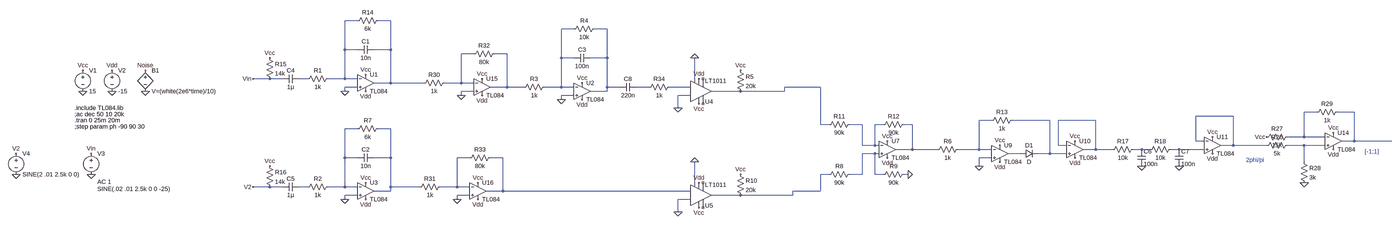
[diagram p0: schematic circuit_complet.asc, whole sheet]
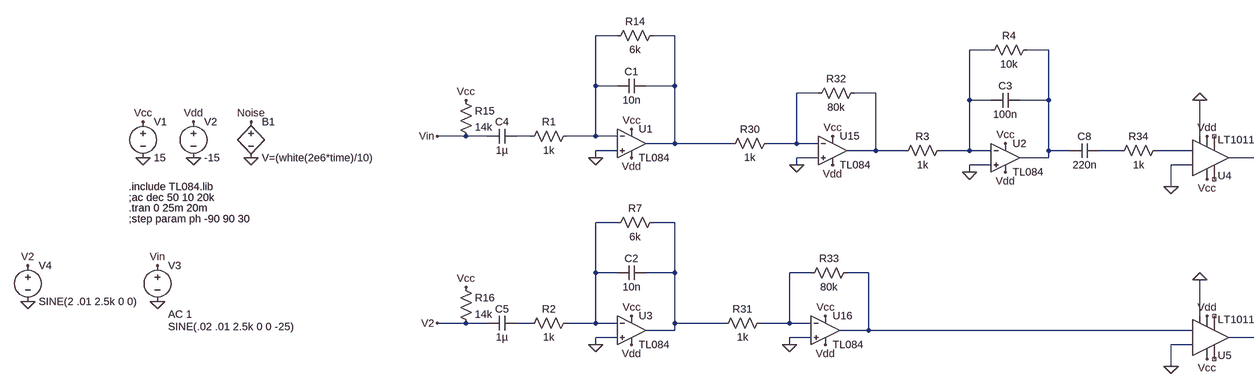
[diagram p1: schematic circuit_complet.asc, part, row 1 of 1, column 1 of 2]
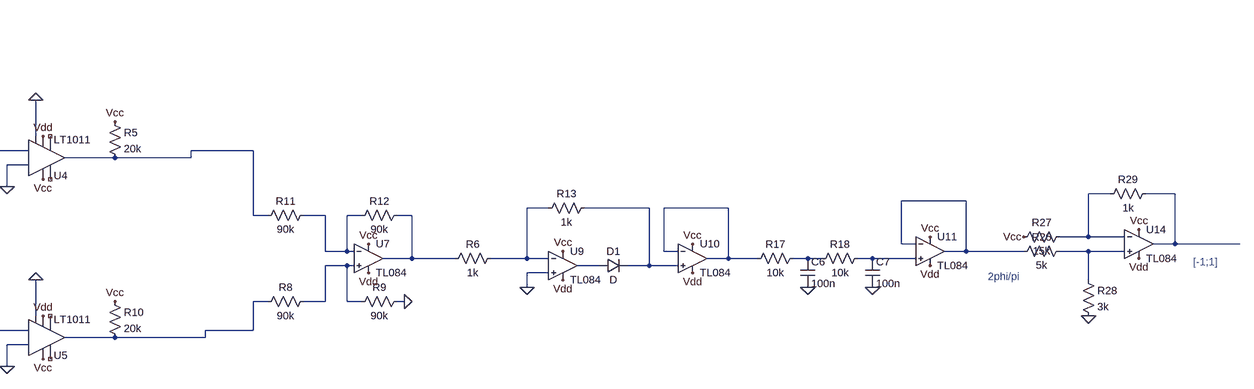
[diagram p2: schematic circuit_complet.asc, part, row 1 of 1, column 2 of 2]
circuit_complet.asc, the LTspice schematic file:
Version 4
SHEET 1 5272 756
WIRE -304 -64 -352 -64
WIRE -176 -64 -224 -64
WIRE 560 -32 512 -32
WIRE 688 -32 640 -32
WIRE -352 48 -352 -64
WIRE -304 48 -352 48
WIRE -176 48 -176 -64
WIRE -176 48 -240 48
WIRE 176 64 128 64
WIRE 304 64 256 64
WIRE 512 80 512 -32
WIRE 560 80 512 80
WIRE 688 80 688 -32
WIRE 688 80 624 80
WIRE -640 160 -704 160
WIRE -592 160 -640 160
WIRE -496 160 -528 160
WIRE -352 160 -352 48
WIRE -352 160 -416 160
WIRE -304 160 -352 160
WIRE 1024 160 1024 80
WIRE -176 176 -176 48
WIRE -176 176 -240 176
WIRE -16 176 -176 176
WIRE 128 176 128 64
WIRE 128 176 64 176
WIRE 176 176 128 176
WIRE -304 192 -352 192
WIRE 304 192 304 64
WIRE 304 192 240 192
WIRE 368 192 304 192
WIRE 512 192 512 80
WIRE 512 192 448 192
WIRE 560 192 512 192
WIRE 688 192 688 80
WIRE 736 192 688 192
WIRE 848 192 800 192
WIRE 1008 192 928 192
WIRE 1664 192 1472 192
WIRE -352 208 -352 192
WIRE 176 208 128 208
WIRE 688 208 688 192
WIRE 688 208 624 208
WIRE 1200 208 1088 208
WIRE 1472 208 1472 192
WIRE 1472 208 1200 208
WIRE 128 224 128 208
WIRE 560 224 512 224
WIRE 1008 224 960 224
WIRE 512 240 512 224
WIRE 960 272 960 224
WIRE 3568 288 3520 288
WIRE 3712 288 3648 288
WIRE 3248 304 3104 304
WIRE 2320 320 2272 320
WIRE 2544 320 2400 320
WIRE 2720 320 2576 320
WIRE 1664 336 1664 192
WIRE 1696 336 1664 336
WIRE 1824 336 1776 336
WIRE 1904 336 1872 336
WIRE 2016 336 1984 336
WIRE -304 352 -352 352
WIRE -176 352 -224 352
WIRE 3520 384 3520 288
WIRE 3520 384 3456 384
WIRE 3600 384 3520 384
WIRE 3104 400 3104 304
WIRE 3136 400 3104 400
WIRE 3712 400 3712 288
WIRE 3712 400 3664 400
WIRE 3856 400 3712 400
WIRE 1824 416 1824 336
WIRE 1872 416 1872 336
WIRE 1872 416 1824 416
WIRE 1888 416 1872 416
WIRE 2576 416 2576 320
WIRE 2608 416 2576 416
WIRE 3248 416 3248 304
WIRE 3248 416 3200 416
WIRE 3376 416 3248 416
WIRE 3520 416 3456 416
WIRE 3600 416 3520 416
WIRE 2016 432 2016 336
WIRE 2016 432 1952 432
WIRE 2112 432 2016 432
WIRE 2272 432 2272 320
WIRE 2272 432 2192 432
WIRE 2320 432 2272 432
WIRE 2720 432 2720 320
WIRE 2720 432 2672 432
WIRE 2784 432 2720 432
WIRE 2896 432 2864 432
WIRE 2928 432 2896 432
WIRE 3040 432 3008 432
WIRE 3136 432 3040 432
WIRE 1872 448 1824 448
WIRE 1888 448 1872 448
WIRE 2432 448 2384 448
WIRE 2544 448 2544 320
WIRE 2544 448 2496 448
WIRE 2608 448 2544 448
WIRE -352 464 -352 352
WIRE -304 464 -352 464
WIRE -176 464 -176 352
WIRE -176 464 -240 464
WIRE 160 464 112 464
WIRE 288 464 240 464
WIRE 2320 464 2272 464
WIRE 3520 480 3520 416
WIRE 2272 496 2272 464
WIRE 1696 528 1664 528
WIRE 1824 528 1824 448
WIRE 1824 528 1776 528
WIRE 1872 528 1872 448
WIRE 1904 528 1872 528
WIRE 2000 528 1984 528
WIRE 1024 560 1024 480
WIRE -640 576 -704 576
WIRE -592 576 -640 576
WIRE -496 576 -528 576
WIRE -352 576 -352 464
WIRE -352 576 -416 576
WIRE -304 576 -352 576
WIRE -176 576 -176 464
WIRE -32 576 -176 576
WIRE 112 576 112 464
WIRE 112 576 48 576
WIRE 160 576 112 576
WIRE -176 592 -176 576
WIRE -176 592 -240 592
WIRE 288 592 288 464
WIRE 288 592 224 592
WIRE 1008 592 288 592
WIRE 1664 592 1664 528
WIRE 1664 592 1504 592
WIRE -304 608 -352 608
WIRE 160 608 112 608
WIRE 1200 608 1088 608
WIRE 1504 608 1504 592
WIRE 1504 608 1200 608
WIRE -352 624 -352 608
WIRE 112 624 112 608
WIRE 1008 624 960 624
WIRE 960 672 960 624
FLAG -1504 528 0
FLAG -1536 208 0
FLAG -1424 208 0
FLAG -1424 128 Vdd
FLAG -1536 128 Vcc
FLAG -1504 448 Vin
FLAG -1296 208 0
FLAG -1296 128 Noise
FLAG 592 176 Vcc
FLAG 592 240 Vdd
FLAG 512 240 0
FLAG 960 272 0
FLAG 1024 80 0
FLAG 1040 256 Vcc
FLAG 1040 160 Vdd
FLAG 1200 128 Vcc
FLAG 960 672 0
FLAG 1024 480 0
FLAG 1040 656 Vcc
FLAG 1040 560 Vdd
FLAG 1200 528 Vcc
FLAG 1920 400 Vcc
FLAG 1920 464 Vdd
FLAG 2000 528 0
FLAG -1792 528 0
FLAG -1792 448 V2
FLAG 2352 416 Vcc
FLAG 2352 480 Vdd
FLAG 2272 496 0
FLAG 2640 400 Vcc
FLAG 2640 464 Vdd
FLAG 2896 496 0
FLAG 3040 496 0
FLAG 3168 384 Vcc
FLAG 3168 448 Vdd
FLAG 3520 560 0
FLAG 3632 368 Vcc
FLAG 3632 432 Vdd
FLAG 3376 384 Vcc
FLAG -272 144 Vcc
FLAG -272 208 Vdd
FLAG -352 208 0
FLAG -272 560 Vcc
FLAG -272 624 Vdd
FLAG -352 624 0
FLAG -704 160 Vin
FLAG -704 576 V2
FLAG -640 496 Vcc
FLAG 208 160 Vcc
FLAG 208 224 Vdd
FLAG 128 224 0
FLAG 192 560 Vcc
FLAG 192 624 Vdd
FLAG 112 624 0
FLAG -640 80 Vcc
SYMBOL voltage -1536 112 R0
WINDOW 123 0 0 Left 0
WINDOW 39 0 0 Left 0
SYMATTR InstName V1
SYMATTR Value 15
SYMBOL voltage -1424 112 R0
WINDOW 123 0 0 Left 0
WINDOW 39 0 0 Left 0
SYMATTR InstName V2
SYMATTR Value -15
SYMBOL voltage -1504 432 R0
WINDOW 123 24 124 Left 2
WINDOW 39 0 0 Left 0
WINDOW 3 24 152 Left 2
SYMATTR Value2 AC 1
SYMATTR Value SINE(.02 .01 2.5k 0 0 -25)
SYMATTR InstName V3
SYMBOL bv -1296 112 R0
SYMATTR InstName B1
SYMATTR Value V=(white(2e6*time)/10)
SYMBOL res 464 176 R90
WINDOW 0 0 56 VBottom 2
WINDOW 3 32 56 VTop 2
SYMATTR InstName R3
SYMATTR Value 1k
SYMBOL res 656 -48 R90
WINDOW 0 0 56 VBottom 2
WINDOW 3 32 56 VTop 2
SYMATTR InstName R4
SYMATTR Value 10k
SYMBOL cap 624 64 R90
WINDOW 0 0 32 VBottom 2
WINDOW 3 32 32 VTop 2
SYMATTR InstName C3
SYMATTR Value 100n
SYMBOL Opamps\\opamp2 592 144 R0
SYMATTR InstName U2
SYMATTR Value TL084
SYMBOL Comparators\\LT1011 1040 208 M180
SYMATTR InstName U4
SYMBOL res 1184 112 R0
SYMATTR InstName R5
SYMATTR Value 20k
SYMBOL res 1184 512 R0
SYMATTR InstName R10
SYMATTR Value 20k
SYMBOL res 1792 320 R90
WINDOW 0 0 56 VBottom 2
WINDOW 3 32 56 VTop 2
SYMATTR InstName R11
SYMATTR Value 90k
SYMBOL Opamps\\opamp2 1920 368 R0
SYMATTR InstName U7
SYMATTR Value TL084
SYMBOL res 2000 320 R90
WINDOW 0 0 56 VBottom 2
WINDOW 3 32 56 VTop 2
SYMATTR InstName R12
SYMATTR Value 90k
SYMBOL res 1792 512 R90
WINDOW 0 0 56 VBottom 2
WINDOW 3 32 56 VTop 2
SYMATTR InstName R8
SYMATTR Value 90k
SYMBOL res 2000 512 R90
WINDOW 0 0 56 VBottom 2
WINDOW 3 32 56 VTop 2
SYMATTR InstName R9
SYMATTR Value 90k
SYMBOL voltage -1792 432 R0
WINDOW 123 0 0 Left 0
WINDOW 39 0 0 Left 0
SYMATTR InstName V4
SYMATTR Value SINE(2 .01 2.5k 0 0)
SYMBOL Comparators\\LT1011 1040 608 M180
SYMATTR InstName U5
SYMBOL res 2208 416 R90
WINDOW 0 0 56 VBottom 2
WINDOW 3 32 56 VTop 2
SYMATTR InstName R6
SYMATTR Value 1k
SYMBOL res 2416 304 R90
WINDOW 0 0 56 VBottom 2
WINDOW 3 32 56 VTop 2
SYMATTR InstName R13
SYMATTR Value 1k
SYMBOL Opamps\\opamp2 2352 384 R0
SYMATTR InstName U9
SYMATTR Value TL084
SYMBOL diode 2432 464 R270
WINDOW 0 32 32 VTop 2
WINDOW 3 0 32 VBottom 2
SYMATTR InstName D1
SYMBOL Opamps\\opamp2 2640 368 R0
SYMATTR InstName U10
SYMATTR Value TL084
SYMBOL res 2880 416 R90
WINDOW 0 0 56 VBottom 2
WINDOW 3 32 56 VTop 2
SYMATTR InstName R17
SYMATTR Value 10k
SYMBOL res 3024 416 R90
WINDOW 0 0 56 VBottom 2
WINDOW 3 32 56 VTop 2
SYMATTR InstName R18
SYMATTR Value 10k
SYMBOL cap 2880 432 R0
SYMATTR InstName C6
SYMATTR Value 100n
SYMATTR SpiceLine V=4 Irms=0 Rser=0 Lser=0
SYMBOL cap 3024 432 R0
SYMATTR InstName C7
SYMATTR Value 100n
SYMBOL Opamps\\opamp2 3168 352 R0
SYMATTR InstName U11
SYMATTR Value TL084
SYMBOL res 3472 400 R90
WINDOW 0 0 56 VBottom 2
WINDOW 3 32 56 VTop 2
SYMATTR InstName R26
SYMATTR Value 5k
SYMBOL res 3504 464 R0
SYMATTR InstName R28
SYMATTR Value 3k
SYMBOL res 3664 272 R90
WINDOW 0 0 56 VBottom 2
WINDOW 3 32 56 VTop 2
SYMATTR InstName R29
SYMATTR Value 1k
SYMBOL res 3472 368 R90
WINDOW 0 0 56 VBottom 2
WINDOW 3 32 56 VTop 2
SYMATTR InstName R27
SYMATTR Value 15k
SYMBOL Opamps\\opamp2 3632 336 R0
SYMATTR InstName U14
SYMATTR Value TL084
SYMBOL res -400 144 R90
WINDOW 0 0 56 VBottom 2
WINDOW 3 32 56 VTop 2
SYMATTR InstName R1
SYMATTR Value 1k
SYMBOL cap -240 32 R90
WINDOW 0 0 32 VBottom 2
WINDOW 3 32 32 VTop 2
SYMATTR InstName C1
SYMATTR Value 10n
SYMBOL Opamps\\opamp2 -272 112 R0
SYMATTR InstName U1
SYMATTR Value TL084
SYMBOL res -208 -80 R90
WINDOW 0 0 56 VBottom 2
WINDOW 3 32 56 VTop 2
SYMATTR InstName R14
SYMATTR Value 6k
SYMBOL cap -528 144 R90
WINDOW 0 0 32 VBottom 2
WINDOW 3 32 32 VTop 2
SYMATTR InstName C4
SYMATTR Value 1µ
SYMBOL res -400 560 R90
WINDOW 0 0 56 VBottom 2
WINDOW 3 32 56 VTop 2
SYMATTR InstName R2
SYMATTR Value 1k
SYMBOL cap -240 448 R90
WINDOW 0 0 32 VBottom 2
WINDOW 3 32 32 VTop 2
SYMATTR InstName C2
SYMATTR Value 10n
SYMBOL Opamps\\opamp2 -272 528 R0
SYMATTR InstName U3
SYMATTR Value TL084
SYMBOL res -208 336 R90
WINDOW 0 0 56 VBottom 2
WINDOW 3 32 56 VTop 2
SYMATTR InstName R7
SYMATTR Value 6k
SYMBOL cap -528 560 R90
WINDOW 0 0 32 VBottom 2
WINDOW 3 32 32 VTop 2
SYMATTR InstName C5
SYMATTR Value 1µ
SYMBOL res -656 480 R0
SYMATTR InstName R16
SYMATTR Value 14k
SYMBOL res 80 160 R90
WINDOW 0 0 56 VBottom 2
WINDOW 3 32 56 VTop 2
SYMATTR InstName R30
SYMATTR Value 1k
SYMBOL Opamps\\opamp2 208 128 R0
SYMATTR InstName U15
SYMATTR Value TL084
SYMBOL res 64 560 R90
WINDOW 0 0 56 VBottom 2
WINDOW 3 32 56 VTop 2
SYMATTR InstName R31
SYMATTR Value 1k
SYMBOL Opamps\\opamp2 192 528 R0
SYMATTR InstName U16
SYMATTR Value TL084
SYMBOL res 272 48 R90
WINDOW 0 0 56 VBottom 2
WINDOW 3 32 56 VTop 2
SYMATTR InstName R32
SYMATTR Value 80k
SYMBOL res 256 448 R90
WINDOW 0 0 56 VBottom 2
WINDOW 3 32 56 VTop 2
SYMATTR InstName R33
SYMATTR Value 80k
SYMBOL res -656 64 R0
SYMATTR InstName R15
SYMATTR Value 14k
SYMBOL cap 800 176 R90
WINDOW 0 0 32 VBottom 2
WINDOW 3 32 32 VTop 2
SYMATTR InstName C8
SYMATTR Value 220n
SYMBOL res 944 176 R90
WINDOW 0 0 56 VBottom 2
WINDOW 3 32 56 VTop 2
SYMATTR InstName R34
SYMATTR Value 1k
TEXT -1568 296 Left 2 !;ac dec 50 10 20k
TEXT -1568 320 Left 2 !.tran 0 25m 20m
TEXT -1568 272 Left 2 !.include TL084.lib
TEXT -1568 344 Left 2 !;step param ph -90 90 30
TEXT 3296 472 Left 2 ;2phi/pi
TEXT 3752 440 Left 2 ;[-1;1]

The netlist it stands for:
* circuit_complet.asc
V1 Vcc 0 15
V2 Vdd 0 -15
V3 Vin 0 SINE(.02 .01 2.5k 0 0 -25) AC 1
B1 Noise 0 V=(white(2e6*time)/10)
R3 N003 N006 1k
R4 N004 N003 10k
C3 N004 N003 100n
XU2 0 N003 Vcc Vdd N004 TL084  ; pins In+ In- V+ V- OUT
XU4 0 N009 0 Vdd NC_01 NC_02 N010 Vcc LT1011
R5 Vcc N010 20k
R10 Vcc N028 20k
R11 N017 N010 90k
XU7 N024 N017 Vcc Vdd N018 TL084  ; pins In+ In- V+ V- OUT
R12 N018 N017 90k
R8 N024 N028 90k
R9 0 N024 90k
V4 V2 0 SINE(2 .01 2.5k 0 0)
XU5 0 N027 0 Vdd NC_03 NC_04 N028 Vcc LT1011
R6 N014 N018 1k
R13 N015 N014 1k
XU9 0 N014 Vcc Vdd N025 TL084  ; pins In+ In- V+ V- OUT
D1 N025 N015 D
XU10 N015 N016 Vcc Vdd N016 TL084  ; pins In+ In- V+ V- OUT
R17 N022 N016 10k
R18 N023 N022 10k
C6 N022 0 100n V=4 Irms=0 Rser=0 Lser=0
C7 N023 0 100n
XU11 N023 N013 Vcc Vdd N013 TL084  ; pins In+ In- V+ V- OUT
R26 N021 N013 5k
R28 N021 0 3k
R29 N012 N011 1k
R27 N011 Vcc 15k
XU14 N021 N011 Vcc Vdd N012 TL084  ; pins In+ In- V+ V- OUT
R1 N001 N007 1k
C1 N002 N001 10n
XU1 0 N001 Vcc Vdd N002 TL084  ; pins In+ In- V+ V- OUT
R14 N002 N001 6k
C4 N007 Vin 1µ
R2 N019 N029 1k
C2 N020 N019 10n
XU3 0 N019 Vcc Vdd N020 TL084  ; pins In+ In- V+ V- OUT
R7 N020 N019 6k
C5 N029 V2 1µ
R16 Vcc V2 14k
R30 N005 N002 1k
XU15 0 N005 Vcc Vdd N006 TL084  ; pins In+ In- V+ V- OUT
R31 N026 N020 1k
XU16 0 N026 Vcc Vdd N027 TL084  ; pins In+ In- V+ V- OUT
R32 N006 N005 80k
R33 N027 N026 80k
R15 Vcc Vin 14k
C8 N008 N004 220n
R34 N009 N008 1k
.model D D
.lib standard.dio
;ac dec 50 10 20k
.tran 0 25m 20m
.include TL084.lib
;step param ph -90 90 30
* 2phi/pi
* [-1;1]
.lib LTC1.lib
.backanno
.end